# Altium project 7798-20-0228.PrjPcb
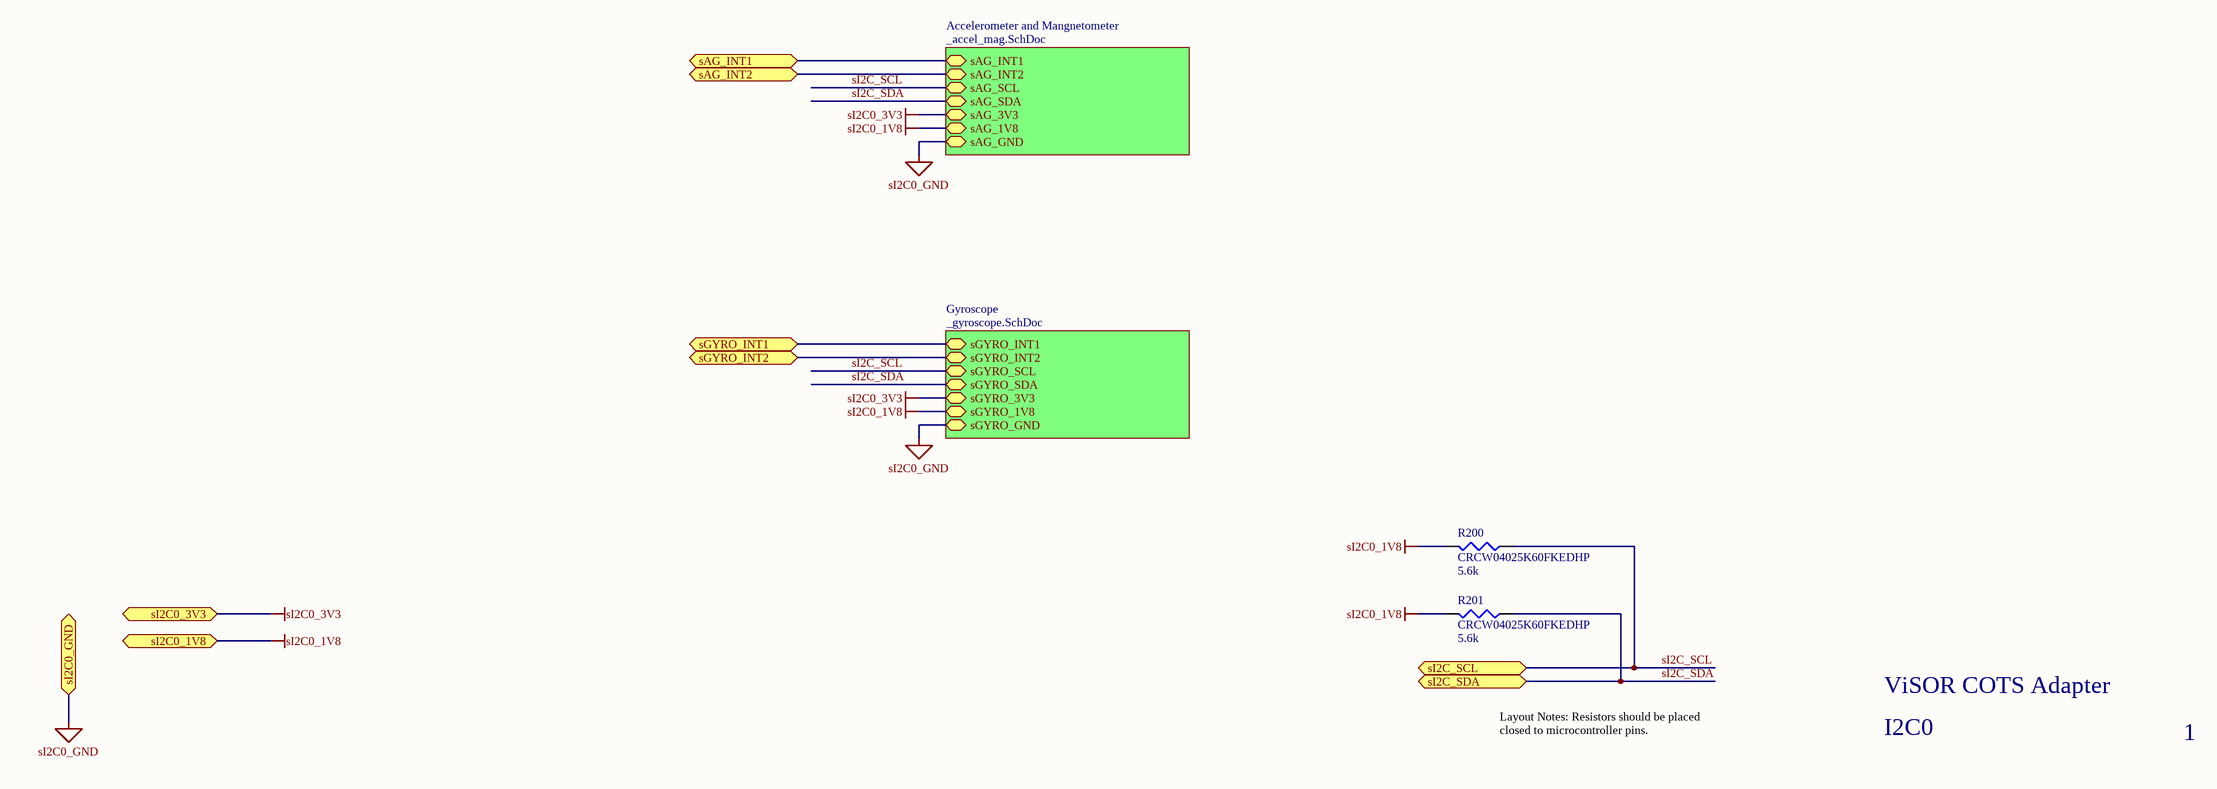
[diagram p0: _i2c0.SchDoc]
2 sheets, 7 parts. Net scope: strictly hierarchical (ports join the sheet entries above them; power ports are local).
Board file: 7798-20-0228.PcbDoc
Sheets:
  _i2c0.SchDoc
  _power.SchDoc

## Sheet _i2c0.SchDoc
size Tabloid

### Parts
R200  CRCW04025K60FKEDHP  value 5.6k  [0402]
R201  CRCW04025K60FKEDHP  value 5.6k  [0402]

### Sub-sheets
Accelerometer and Mangnetometer = _accel_mag.SchDoc (file not in this document): sAG_3V3, sAG_GND, sAG_SCL, sAG_SDA, sAG_INT1, sAG_INT2, sAG_1V8
Gyroscope = _gyroscope.SchDoc (file not in this document): sGYRO_3V3, sGYRO_GND, sGYRO_INT1, sGYRO_INT2, sGYRO_SCL, sGYRO_SDA, sGYRO_1V8

### Ports
sAG_INT1, sAG_INT2, sGYRO_INT1, sGYRO_INT2, sI2C0_1V8, sI2C0_3V3, sI2C0_GND, sI2C_SCL, sI2C_SDA

### Nets
sI2C0_1V8: R200.2 R201.2 ; port sI2C0_1V8, sheet Accelerometer and Mangnetometer/sAG_1V8, sheet Gyroscope/sGYRO_1V8
sI2C0_3V3: port sI2C0_3V3, sheet Accelerometer and Mangnetometer/sAG_3V3, sheet Gyroscope/sGYRO_3V3
sI2C0_GND: port sI2C0_GND, sheet Accelerometer and Mangnetometer/sAG_GND, sheet Gyroscope/sGYRO_GND
sI2C_SCL: R200.1 ; port sI2C_SCL, sheet Accelerometer and Mangnetometer/sAG_SCL, sheet Gyroscope/sGYRO_SCL
sI2C_SDA: R201.1 ; port sI2C_SDA, sheet Accelerometer and Mangnetometer/sAG_SDA, sheet Gyroscope/sGYRO_SDA
(unnamed): port sAG_INT1, sheet Accelerometer and Mangnetometer/sAG_INT1
(unnamed): port sAG_INT2, sheet Accelerometer and Mangnetometer/sAG_INT2
(unnamed): port sGYRO_INT1, sheet Gyroscope/sGYRO_INT1
(unnamed): port sGYRO_INT2, sheet Gyroscope/sGYRO_INT2

### Notes on the sheet
- ViSOR COTS Adapter
- Layout Notes: Resistors should be placed closed to microcontroller pins.
- I2C0
- 1

### Library data of the parts
R200 R201 = CRCW0402xxxxFKED: 0.125W, -55-155C, 1005, 50V, ±1%

## Sheet _power.SchDoc
size Tabloid
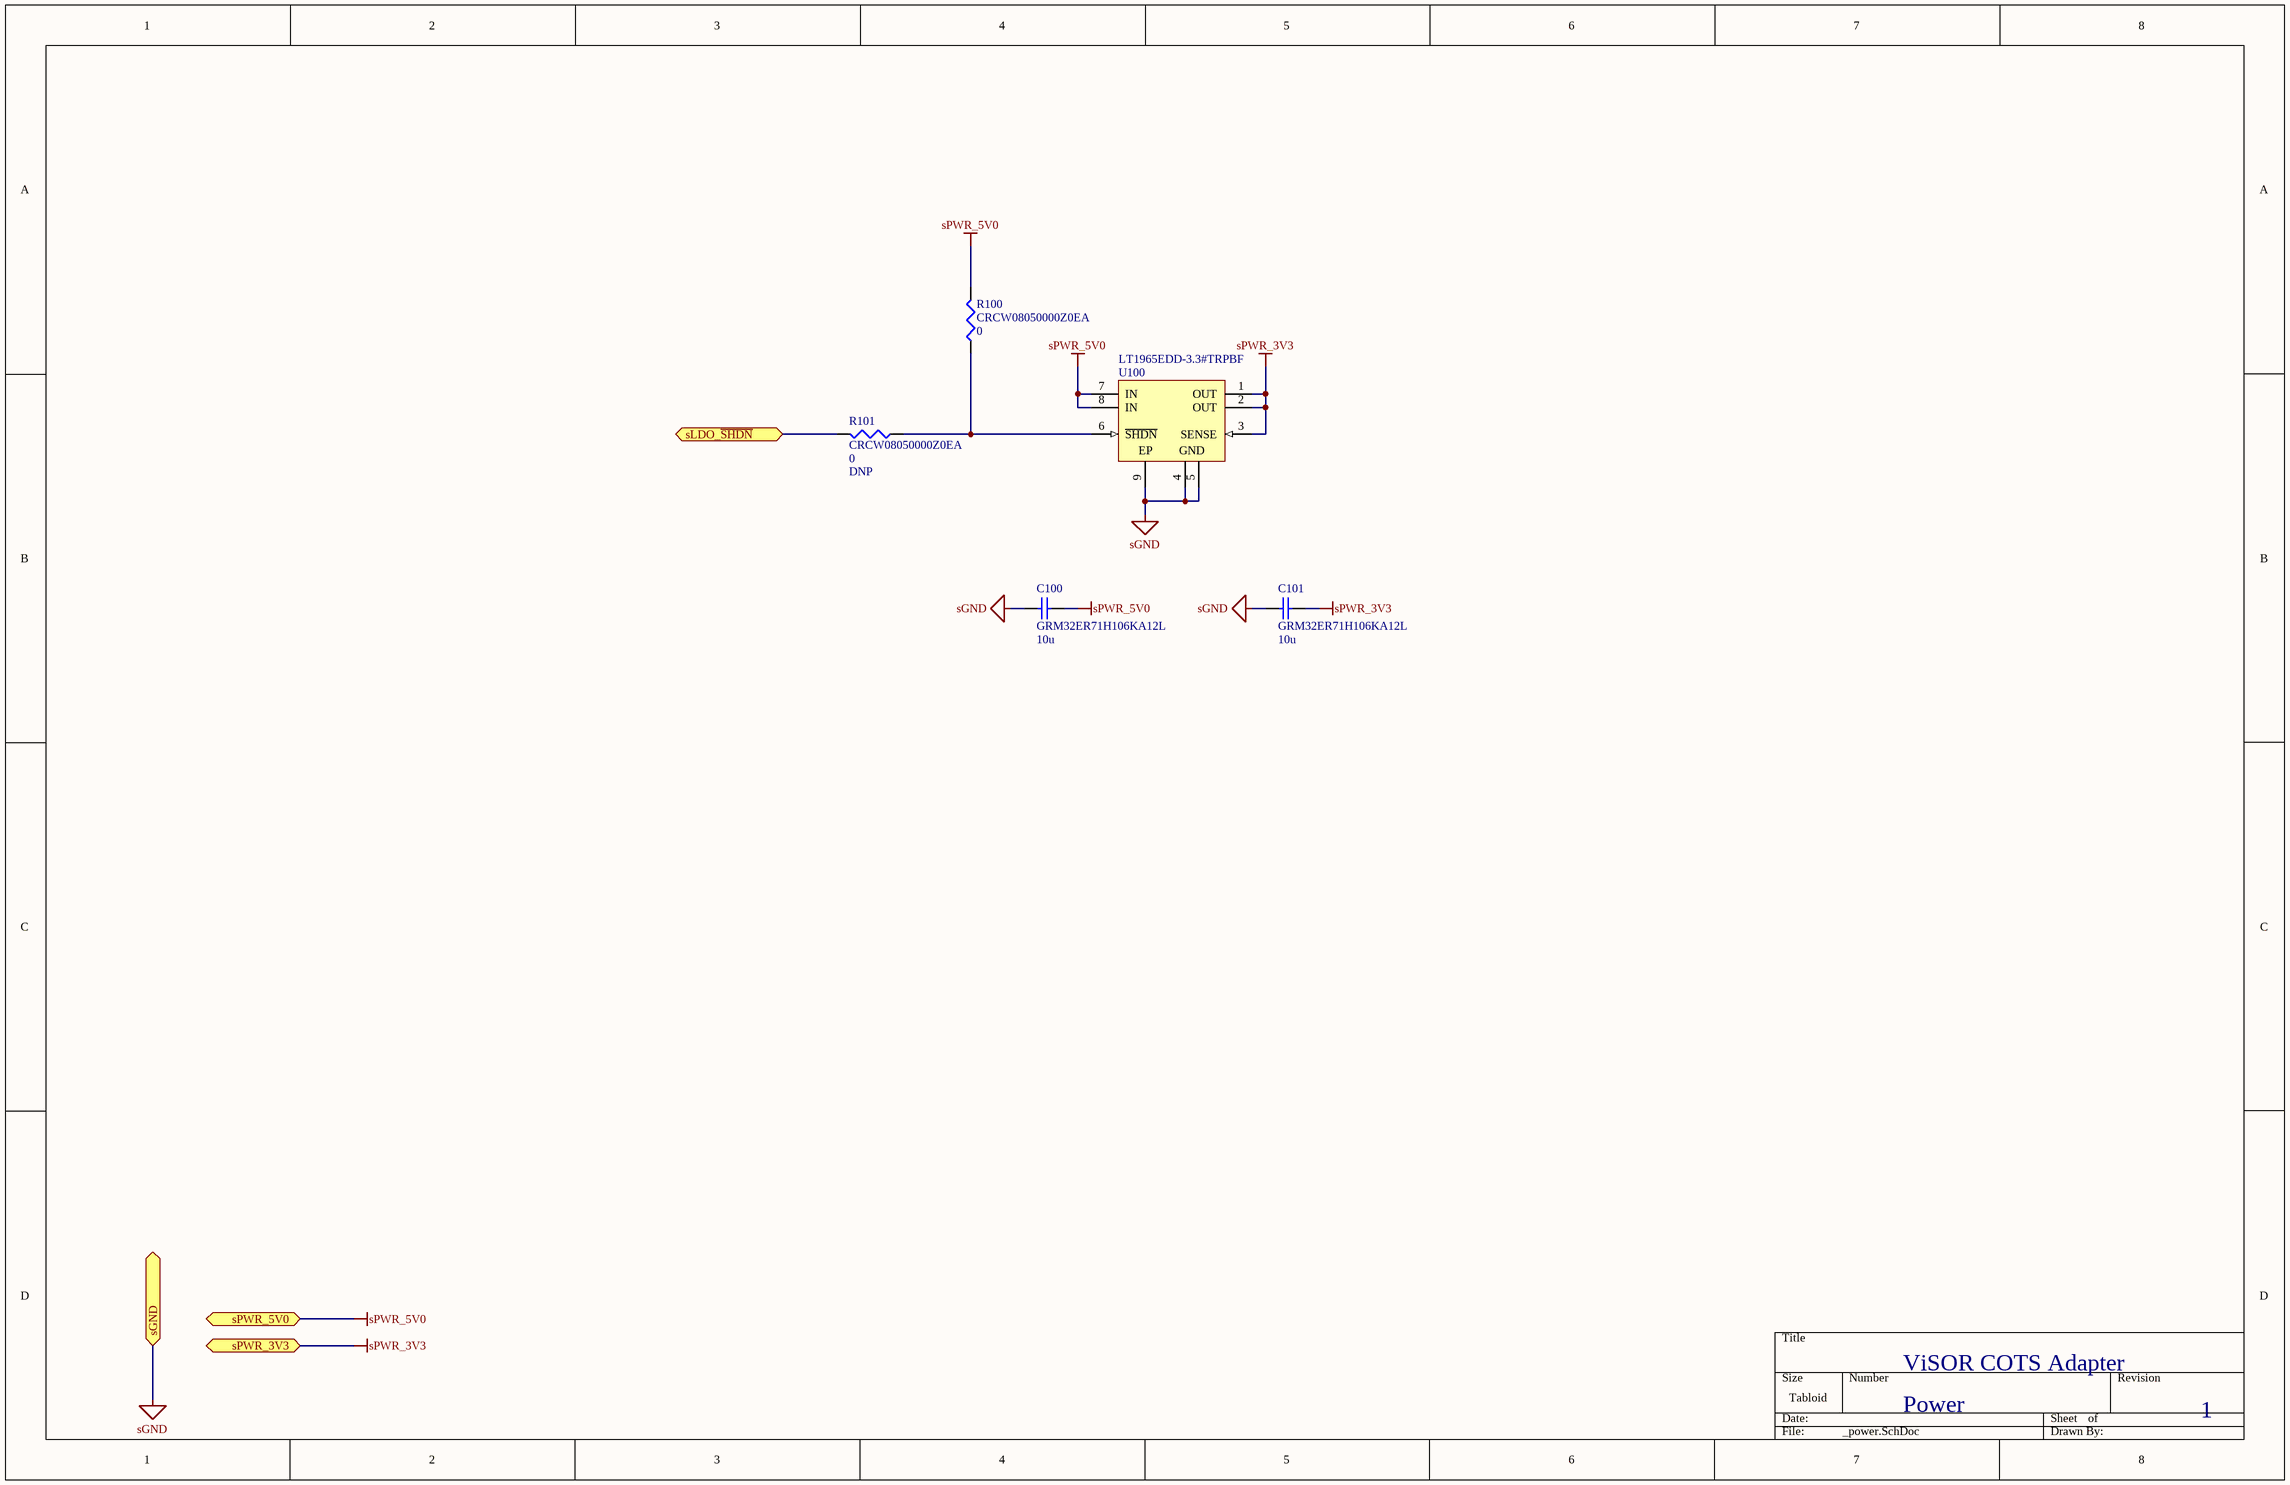
[diagram p1: _power.SchDoc]

### Parts
C100  GRM32ER71H106KA12L  value 10u  [1210]
C101  GRM32ER71H106KA12L  value 10u  [1210]
R100  CRCW08050000Z0EA  value 0  [6-0805_M]
R101  CRCW08050000Z0EA  value 0  [6-0805_M]
U100  LT1965EDD-3.3#TRPBF  [LT-DD-8_V - MOD]

### Ports
sGND, sLDO_~{SHDN}, sPWR_3V3, sPWR_5V0

### Nets
sGND: C100.1 C101.1 U100.4(GND) U100.5(GND) U100.9(EP) ; port sGND
sPWR_3V3: C101.2 U100.1(OUT) U100.2(OUT) U100.3(SENSE) ; port sPWR_3V3
sPWR_5V0: C100.2 R100.2 U100.7(IN) U100.8(IN) ; port sPWR_5V0
NetR100_1: R100.1 R101.1 U100.6(~{SHDN})
NetR101_2: R101.2 ; port sLDO_~{SHDN}

### Notes on the sheet
- ViSOR COTS Adapter
- Power
- 1
- (in symbol Res3) DNP

### Library data of the parts
C100 C101 = GRM32ER71HxxxKdddd: -55-125C, 1005, 50V, X7R, ±10%
R100 R101 = Res3: 0Ω Resistor; Published: 8-Jun-2000; LatestRevisionDate: 29-May-2009; LatestRevisionNote: IPC-7351 Footprint Added.; PackageReference: J1-0603; Publisher: Altium Limited; PackageDescription: Chip Resistor
U100 = LT1965EDD-3.3#TRPBF: 1.1 A, Low Noise, Low Dropout Linear Regulator, 1.8 to 20 V Vin, 3.3 V Vout, 8-pin SON (DD-8), -40 to 125 degC, Pb-Free, Tape and Reel; Manufacturer: Linear Technology; Discrete Pass Element: no; Dropout Voltage(V): 0.31; Iout(mA): 1100; Isupply(mA): 0.5; Noise(uV): 40; Number of Outputs: 1; Output Voltage: 3.3 V; PSRR(dB): 75; Vin Max(V): 20; Vin Min(V): 1.8; DatasheetVersion: Rev. A; PackageVersion: Jun-10; PackageReference: DD-8; PackageDescription: 8-Pin Plastic DFN, Body 3 x 3 mm, Pitch 0.5 mm; Supplier 1: Digi-Key; Supplier Part Number 1: LT1965EDD-3.3#TRPBF-ND; Packing: Tape and Reel; RoHS: TRUE; Shutdown Current(uA): 1; Mounting Technology: Surface Mount; Code_JEDEC: MO-229; PartNumber: LT1965EDD-3.3#TRPBF; ComponentLink1Description: Manufacturer URL; ComponentLink1URL: http://www.linear.com/; ComponentLink2Description: Datasheet; ComponentLink2URL: http://cds.linear.com/docs/en/datasheet/1965fa.pdf; ComponentLink3Description: Package Specification; ComponentLink3URL: http://cds.linear.com/docs/en/packaging/DFN_8_05-08-1698.pdf